# EAGLE schematic Attiny_pjon_v02 (EAGLE 7.3.0)
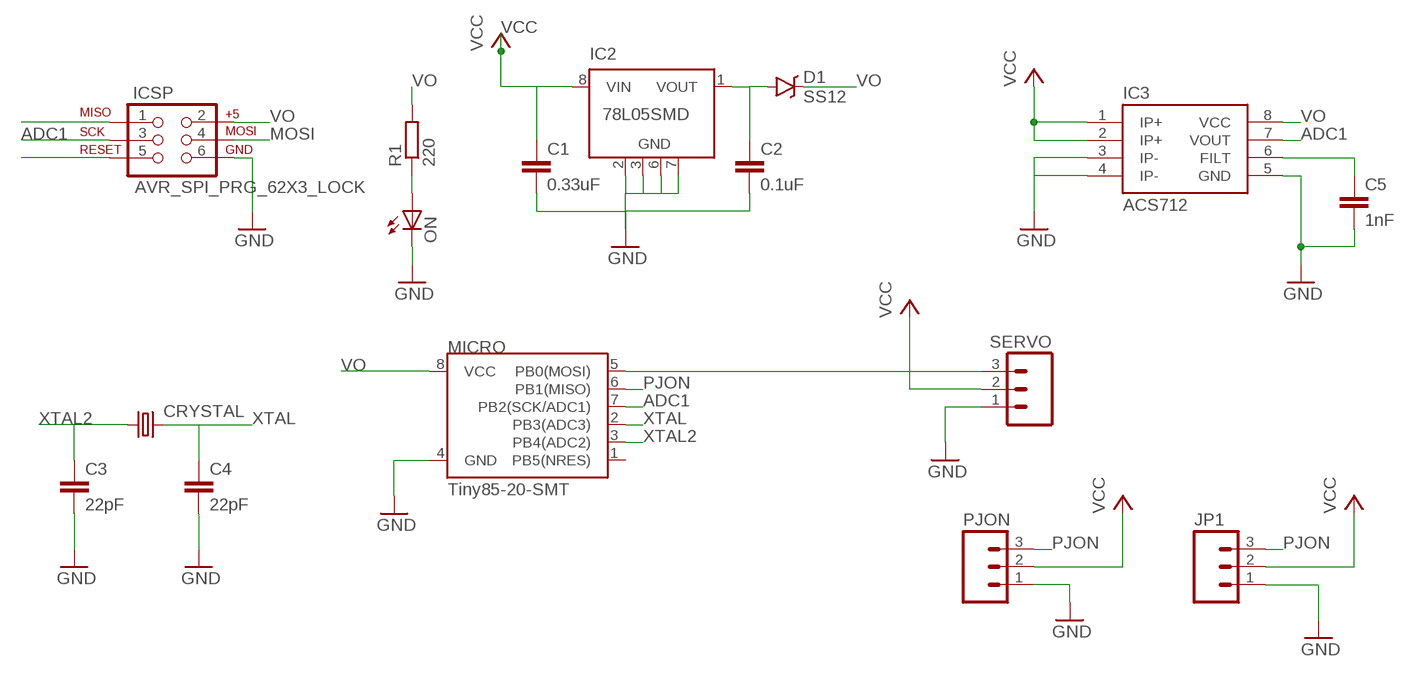
[diagram p0: schematic, sheet 1]

## Parts
C1  0.33uF  C-EUC1206  [C1206]
C2  0.1uF  C-EUC1206  [C1206]
C3  22pF  C-EUC1206  [C1206]
C4  22pF  C-EUC1206  [C1206]
C5  1nF  C-EUC1206  [C1206]
CRYSTAL  CRYSTALSMD  [HC49UP]
D1  SS12  DIODE-SCHOTTKY-B340A  [SMA-DIODE]
IC2  78L05SMD  [SO08]
IC3  ACS712  [SO08]
ICSP  AVR_SPI_PRG_62X3_LOCK  [2X3_LOCK]
JP1  M03PTH  [1X03]
MICRO  Tiny85-20-SMT  ATTINY45TINY85-20-SMT  [SO08-EIAJ]
ON  LEDSMT1206  [1206]
PJON  M03PTH  [1X03]
R1  220  R-EU_R1206  [R1206]
SERVO  M03PTH  [1X03]

## Nets
ADC0: ICSP.5
ADC1: IC3.7(VOUT) MICRO.7(PB2(SCK/ADC1))
GND: C1.2 C2.2 C3.2 C4.2 C5.2 IC2.2(GND) IC2.3(GND) IC2.6(GND) IC2.7(GND) IC3.3(IP-) IC3.4(IP-) IC3.5(GND) ICSP.6 JP1.1 MICRO.4(GND) ON.C PJON.1 SERVO.1
MISO: ICSP.1
MOSI: ICSP.4 MICRO.5(PB0(MOSI)) SERVO.3
N$2: C5.1 IC3.6(FILT)
N$3: C2.1 D1.A IC2.1(VOUT)
N$8: ON.A R1.1
PJON: ICSP.3 JP1.3 MICRO.6(PB1(MISO)) PJON.3
VCC: C1.1 IC2.8(VIN) IC3.1(IP+) IC3.2(IP+) JP1.2 PJON.2 SERVO.2
VO: D1.C IC3.8(VCC) ICSP.2 MICRO.8(VCC) R1.2
XTAL: C4.1 CRYSTAL.2 MICRO.2(PB3(ADC3))
XTAL2: C3.1 CRYSTAL.1 MICRO.3(PB4(ADC2))
Unconnected: IC2.4(NC) IC2.5(NC) MICRO.1(PB5(NRES))

## Library data of the parts
C1-C5 = rcl:C-EU: CAPACITOR, European symbol
CRYSTAL = SparkFun-FreqCtrl:CRYSTAL: Various standard crystals. Proven footprints.
D1 = SparkFun-DiscreteSemi:DIODE-SCHOTTKY: Schottky diodes in SFE's production catalog BAT20J 1A 23V 0.62Vf RB751 120mA 40V 0.37Vf PMEG4005EJ 0.5A 40V 0.42Vf MBRA140 1A 40V 0.5Vf B340A 3A 40V SMA; PROD_ID: DIO-09886; VALUE: B340A
IC2 = linear:78L*SMD: Positive VOLTAGE REGULATOR
IC3 = SparkFun-AnalogIC:ACS712: Hall-effect-based isolated linear current sensor; PROD_ID: IC-08964
ICSP = SparkFun-Connectors:AVR_SPI_PRG_6: AVR ISP 6 Pin This is the reduced ISP connector for AVR programming. Common on Arduino. This footprint will take up less PCB space and can be used with a 10-pin to 6-pin adapter such as SKU: BOB-08508 **Special note about "TEST_POINT" package. The stop mask is on the top side, so if you want your programming test points to be on the bottom of your board, make sure to place this package on the bottom side of the board. This also ensure that the orientation to program from the bottom side will be correct.
JP1 PJON SERVO = SparkFun-Connectors:M03: Header 3 Standard 3-pin 0.1" header. Use with straight break away headers (SKU : PRT-00116), right angle break away headers (PRT-00553), swiss pins (PRT-00743), machine pins (PRT-00117), and female headers (PRT-00115). Molex polarized connector foot print use with SKU : PRT-08232 with associated crimp pins and housings.
MICRO = SparkFun-DigitalIC:ATTINY45: Atmel 8-pin 2/4/8kB flash uC; PROD_ID: IC-09092
ON = led:LED: LED OSRAM: - CHIPLED LG R971, LG N971, LY N971, LG Q971, LY Q971, LO R971, LY R971 LH N974, LH R974 LS Q976, LO Q976, LY Q976 LO Q996 - Hyper CHIPLED LW Q18S LB Q993, LB Q99A, LB R99A - SideLED LS A670, LO A670, LY A670, LG A670, LP A670 LB A673, LV A673, LT A673, LW A673 LH A674 LY A675 LS A676, LA A676, LO A676, LY A676, LW A676 LS A679, LY A679, LG A679 - Hyper Micro SIDELED® LS Y876, LA Y876, LO Y876, LY Y876 LT Y87S - SmartLED LW L88C, LW L88S LB L89C, LB L89S, LG L890 LS L89K, LO L89K, LY L89K LS L896, LA L896, LO L896, LY L896 - TOPLED LS T670, LO T670, LY T670, LG T670, LP T670 LSG T670, LSP T670, LSY T670, LOP T670, LYG T670 LG T671, LOG T671, LSG T671 LB T673, LV T673, LT T673, LW T673 LH T674 LS T676, LA T676, LO T676, LY T676, LB T676, LH T676, LSB T676, LW T676 LB T67C, LV T67C, LT T67C, LS T67K, LO T67K, LY T67K, LW E67C LS E67B, LA E67B, LO E67B, LY E67B, LB E67C, LV E67C, LT E67C LW T67C LS T679, LY T679, LG T679 LS T770, LO T770, LY T770, LG T770, LP T770 LB T773, LV T773, LT T773, LW T773 LH T774 LS E675, LA E675, LY E675, LS T675 LS T776, LA T776, LO T776, LY T776, LB T776 LHGB T686 LT T68C, LB T68C - Hyper Mini TOPLED® LB M676 - Mini TOPLED Santana® LG M470 LS M47K, LO M47K, LY M47K Source: http://www.osram.convergy.de LUXEON: - LUMILED® LXK2-PW12-R00, LXK2-PW12-S00, LXK2-PW14-U00, LXK2-PW14-V00 LXK2-PM12-R00, LXK2-PM12-S00, LXK2-PM14-U00 LXK2-PE12-Q00, LXK2-PE12-R00, LXK2-PE12-S00, LXK2-PE14-T00, LXK2-PE14-U00 LXK2-PB12-K00, LXK2-PB12-L00, LXK2-PB12-M00, LXK2-PB14-N00, LXK2-PB14-P00, LXK2-PB14-Q00 LXK2-PR12-L00, LXK2-PR12-M00, LXK2-PR14-Q00, LXK2-PR14-R00 LXK2-PD12-Q00, LXK2-PD12-R00, LXK2-PD12-S00 LXK2-PH12-R00, LXK2-PH12-S00 LXK2-PL12-P00, LXK2-PL12-Q00, LXK2-PL12-R00 Source: www.luxeon.com KINGBRIGHT: KA-3528ASYC Source: www.kingbright.com
R1 = resistor:R-EU_: RESISTOR, European symbol